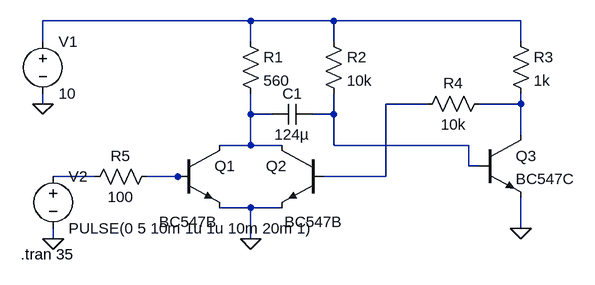
[diagram p0: schematic temp.asc]
temp.asc, the LTspice schematic file:
Version 4
SHEET 1 880 680
WIRE 96 32 -224 32
WIRE 224 32 96 32
WIRE 512 32 224 32
WIRE -224 64 -224 32
WIRE 96 64 96 32
WIRE 224 64 224 32
WIRE 512 64 512 32
WIRE -224 160 -224 144
WIRE 368 160 304 160
WIRE 512 160 512 144
WIRE 512 160 448 160
WIRE 96 176 96 144
WIRE 128 176 96 176
WIRE 224 176 224 144
WIRE 224 176 192 176
WIRE 512 208 512 160
WIRE 96 224 96 176
WIRE 96 224 48 224
WIRE 144 224 96 224
WIRE 224 224 224 176
WIRE 432 224 224 224
WIRE 432 256 432 224
WIRE 448 256 432 256
WIRE -144 272 -208 272
WIRE -16 272 -64 272
WIRE 0 272 -16 272
WIRE 304 272 304 160
WIRE 304 272 208 272
WIRE 96 320 48 320
WIRE 144 320 96 320
WIRE 512 352 512 304
WIRE -208 368 -208 352
WIRE 96 368 96 320
FLAG 96 368 0
FLAG 512 352 0
FLAG -224 160 0
FLAG -208 368 0
SYMBOL res 80 48 R0
SYMATTR InstName R1
SYMATTR Value 560
SYMBOL res 208 48 R0
SYMATTR InstName R2
SYMATTR Value 10k
SYMBOL res 496 48 R0
SYMATTR InstName R3
SYMATTR Value 1k
SYMBOL res 464 144 R90
WINDOW 0 0 56 VBottom 2
WINDOW 3 32 56 VTop 2
SYMATTR InstName R4
SYMATTR Value 10k
SYMBOL npn -16 224 R0
WINDOW 3 -29 118 Left 2
SYMATTR InstName Q1
SYMATTR Value BC547B
SYMBOL npn 448 208 R0
SYMATTR InstName Q3
SYMATTR Value BC547C
SYMBOL res -48 256 R90
WINDOW 0 0 56 VBottom 2
WINDOW 3 32 56 VTop 2
SYMATTR InstName R5
SYMATTR Value 100
SYMBOL voltage -224 48 R0
WINDOW 123 0 0 Left 2
WINDOW 39 0 0 Left 2
SYMATTR InstName V1
SYMATTR Value 10
SYMBOL npn 208 224 M0
WINDOW 3 -29 118 Left 2
SYMATTR InstName Q2
SYMATTR Value BC547B
SYMBOL cap 192 160 R90
WINDOW 0 0 32 VBottom 2
WINDOW 3 32 32 VTop 2
SYMATTR InstName C1
SYMATTR Value 124µ
SYMBOL voltage -208 256 R0
WINDOW 123 0 0 Left 2
WINDOW 39 0 0 Left 2
SYMATTR InstName V2
SYMATTR Value PULSE(0 5 10m 1u 1u 10m 20m 1)
TEXT -258 392 Left 2 !.tran 35

The netlist it stands for:
* temp.asc
R1 N001 N004 560
R2 N001 N005 10k
R3 N001 N003 1k
R4 N003 N002 10k
Q1 N004 N007 0 0 BC547B
Q3 N003 N005 0 0 BC547C
R5 N007 N006 100
V1 N001 0 10
Q2 N004 N002 0 0 BC547B
C1 N005 N004 124µ
V2 N006 0 PULSE(0 5 10m 1u 1u 10m 20m 1)
.model NPN NPN
.model PNP PNP
.lib standard.bjt
.tran 35
.backanno
.end